# EAGLE design Reg-LT (EAGLE 7.6.0)
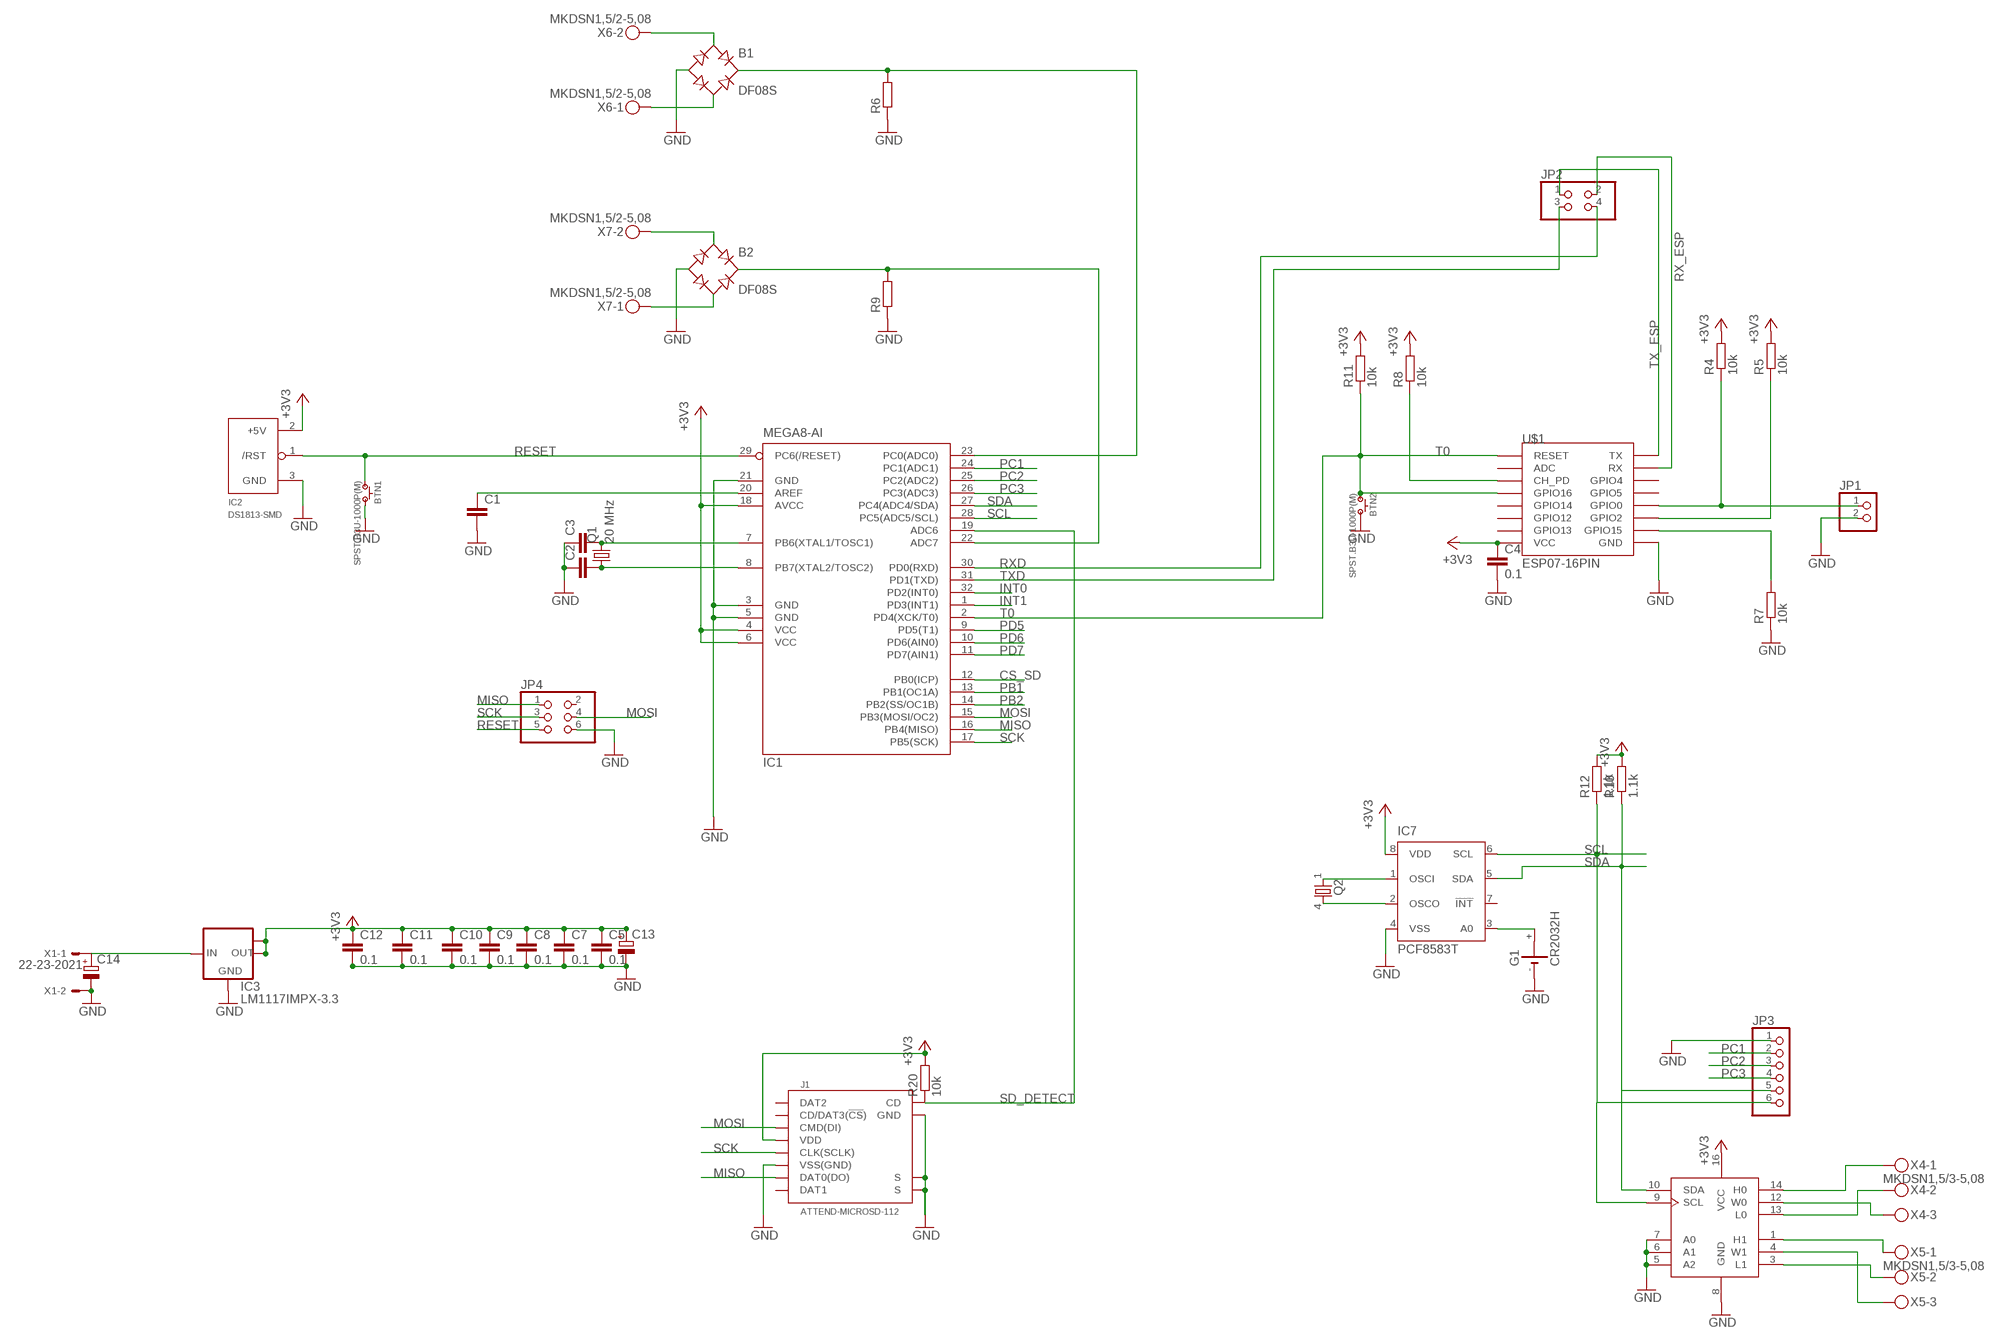
[diagram p0: schematic, sheet 1]

## Parts
B1  DF08S  [DFS]
B2  DF08S  [DFS]
BTN1  SPST.B3U-1000P(M)  [B3U-1000P(M)]
BTN2  SPST.B3U-1000P(M)  [B3U-1000P(M)]
C1  C-EUC0805K  [C0805K]
C2  C-EUC0805  [C0805]
C3  C-EUC0805  [C0805]
C4  0.1  C-EUC0805  [C0805]
C5  0.1  C-EUC0805  [C0805]
C7  0.1  C-EUC0805  [C0805]
C8  0.1  C-EUC0805  [C0805]
C9  0.1  C-EUC0805  [C0805]
C10  0.1  C-EUC0805  [C0805]
C11  0.1  C-EUC0805  [C0805]
C12  0.1  C-EUC0805  [C0805]
C13  CPOL-EU153CLV-0605  [153CLV-0605]
C14  CPOL-EU153CLV-0605  [153CLV-0605]
G1  CR2032H  [CR2032H]
IC1  MEGA8-AI  [TQFP32-08]
IC2  DS1813-SMD  [SOT-23]
IC3  LM1117IMPX-3.3  [SOT223]
IC7  PCF8583T  [SO8-7_5]
J1  ATTEND-MICROSD-112  [ATTEND-112]
JP1  PINHD-1X2  [1X02]
JP2  PINHD-2X2  [2X02]
JP3  PINHD-1X6  [1X06]
JP4  PINHD-2X3  [2X03]
Q1  20 MHz  CRYSTALSM49  [SM49]
Q2  MA306  [MA306]
R4  10k  R-EU_R0805  [R0805]
R5  10k  R-EU_R0805  [R0805]
R6  R-EU_VMTA55  [VMTA55]
R7  10k  R-EU_R0805  [R0805]
R8  10k  R-EU_R0805  [R0805]
R9  R-EU_VMTA55  [VMTA55]
R10  1.1k  R-EU_R0805  [R0805]
R11  10k  R-EU_R0805  [R0805]
R12  1.1k  R-EU_R0805  [R0805]
R20  10k  R-EU_R0805  [R0805]
U$1  ESP07-16PIN  [ESP07-16PIN]
U$5  DS1803ZSO16  [SO16]
X1  22-23-2021  [22-23-2021]
X4  MKDSN1,5/3-5,08  [MKDSN1,5/3-5,08]
X5  MKDSN1,5/3-5,08  [MKDSN1,5/3-5,08]
X6  MKDSN1,5/2-5,08  [MKDSN1,5/2-5,08]
X7  MKDSN1,5/2-5,08  [MKDSN1,5/2-5,08]

## Nets
+3V3: C4.1 C5.1 C7.1 C8.1 C9.1 C10.1 C11.1 C12.1 C13.+ IC1.4(VCC) IC1.6(VCC) IC1.18(AVCC) IC2.2(+5V) IC3.2(OUT) IC3.TAB(OUT1) IC7.8(VDD) J1.VDD R4.2 R5.2 R8.2 R10.2 R11.2 R12.2 R20.2 U$1.VCC U$5.16(VCC)
CS_SD: IC1.12(PB0(ICP))
GND: B1.- B2.- BTN1.2 BTN2.2 C1.2 C2.1 C3.1 C4.2 C5.2 C7.2 C8.2 C9.2 C10.2 C11.2 C12.2 C13.- C14.- G1.- IC1.3(GND) IC1.5(GND) IC1.21(GND) IC2.3(GND) IC3.1(GND) IC7.4(VSS) J1.GND J1.S1(S) J1.S2(S) J1.VSS(VSS(GND)) JP1.2 JP3.1 JP4.6 R6.1 R7.1 R9.1 U$1.GND U$5.5(A2) U$5.6(A1) U$5.7(A0) U$5.8(GND) X1.2
INT0: IC1.32(PD2(INT0))
INT1: IC1.1(PD3(INT1))
MISO: IC1.16(PB4(MISO)) J1.DAT0(DAT0(DO)) JP4.1
MOSI: IC1.15(PB3(MOSI/OC2)) J1.CMD(CMD(DI)) JP4.4
N$1: B2.AC1 X7.2
N$2: C1.1 IC1.20(AREF)
N$3: C3.2 IC1.7(PB6(XTAL1/TOSC1)) Q1.2
N$4: C2.2 IC1.8(PB7(XTAL2/TOSC2)) Q1.1
N$5: B2.AC2 X7.1
N$7: B2.+ IC1.22(ADC7) R9.2
N$8: B1.AC2 X6.1
N$9: JP1.1 R4.1 U$1.GPIO0
N$10: R5.1 U$1.GPIO2
N$11: R7.2 U$1.GPIO15
N$12: R8.1 U$1.CH_PD
N$13: B1.AC1 X6.2
N$15: IC7.1(OSCI) Q2.1
N$16: IC7.2(OSCO) Q2.4
N$18: U$5.13(L0) X4.2
N$23: U$5.12(W0) X4.3
N$24: B1.+ IC1.23(PC0(ADC0)) R6.2
N$25: U$5.14(H0) X4.1
N$26: U$5.1(H1) X5.1
N$27: U$5.3(L1) X5.2
N$28: U$5.4(W1) X5.3
N$33: G1.+ IC7.3(A0)
PB1: IC1.13(PB1(OC1A))
PB2: IC1.14(PB2(SS/OC1B))
PC1: IC1.24(PC1(ADC1)) JP3.2
PC2: IC1.25(PC2(ADC2)) JP3.3
PC3: IC1.26(PC3(ADC3)) JP3.4
PD5: IC1.9(PD5(T1))
PD6: IC1.10(PD6(AIN0))
PD7: IC1.11(PD7(AIN1))
PW: C14.+ IC3.3(IN) X1.1
RESET: BTN1.1 IC1.29(PC6(/RESET)) IC2.1(/RST) JP4.5
RX_ESP: JP2.2 U$1.RX
RXD: IC1.30(PD0(RXD)) JP2.4
SCK: IC1.17(PB5(SCK)) J1.CLK(CLK(SCLK)) JP4.3
SCL: IC1.28(PC5(ADC5/SCL)) IC7.6(SCL) JP3.6 R12.1 U$5.9(SCL)
SD_DETECT: IC1.19(ADC6) J1.CD R20.1
SDA: IC1.27(PC4(ADC4/SDA)) IC7.5(SDA) JP3.5 R10.1 U$5.10(SDA)
T0: BTN2.1 IC1.2(PD4(XCK/T0)) R11.1 U$1.GPIO16 U$1.REST(RESET)
TX_ESP: JP2.1 U$1.TX
TXD: IC1.31(PD1(TXD)) JP2.3
Unconnected: IC7.7(!INT) J1.DAT1 J1.DAT2 J1.DAT3(CD/DAT3(!CS!)) JP4.2 U$1.ADC U$1.GPIO4 U$1.GPIO5 U$1.GPIO12 U$1.GPIO13 U$1.GPIO14

## Library data of the parts
B1 B2 = rectifier:DF*S: Surface Mount Glass Passivated Bridge Rectifiers Source: Source: Comchip Bridge Rectifiers DF005S-G thru DF10S-G.pdf
BTN1 BTN2 = omron:SPST
C1-C5 C7-C12 = rcl:C-EU: CAPACITOR, European symbol
C13 C14 = rcl:CPOL-EU: POLARIZED CAPACITOR, European symbol
G1 = MyLib:CR2032H: LI BATTERY Varta
IC1 = atmel:MEGA8: MICROCONTROLLER 8 Kbytes FLASH, 1 kbytes SRAM, 512 bytes EEPROM, USART, 6-channel 10 bit ADC, 2-channel 8 bit ADC Pin compatible with Atmega48, ATMega88, ATMega168 Source: avr.lbr; MPN: ATMEGA8-16AU; OC_FARNELL: 9171371; OC_NEWARK: 73M8863
IC2 = ds1813_revised:DS1813
IC3 = lm1117:LM1117IMPX-*
IC7 = MyLib:PCF8583: I2C-Bus CLOCK/CALENDAR
J1 = MyLib:ATTEND-MICROSD-112: Attend microSD socket Datasheet: Attend 112 microSD socket <http://www.soselectronic.com/a_info/resource/f/112I-TXAR-R_B_1.pdf>.
JP1 = pinhead:PINHD-1X2: PIN HEADER
JP2 = pinhead:PINHD-2X2: PIN HEADER
JP3 = pinhead:PINHD-1X6: PIN HEADER
JP4 = pinhead:PINHD-2X3: PIN HEADER
Q1 = crystal:CRYSTAL: CRYSTAL; OC_FARNELL: unknown; OC_NEWARK: unknown
Q2 = MyLib:MA306
R4-R12 R20 = rcl:R-EU_: RESISTOR, European symbol
U$1 = esp8266modules:ESP07-16PIN: ESP8266 Wifi module 07 - 16 pins; DIMENSIONS: 22.0 x 16.0 mm; PINS: 16; PITCH: 0.078" / 2 mm
U$5 = MyLib:DS1803Z
X1 = con-molex:22-23-2021: .100" (2.54mm) Center Header - 2 Pin; MF: MOLEX; MPN: 22-23-2021; OC_FARNELL: 1462926; OC_NEWARK: 25C3832
X4 X5 = con-phoenix-508:MKDSN1,5/3-5,08: MKDSN 1,5/ 3-5,08 Printklemme Nennstrom: 13,5 A Nennspannung: 250 V Rastermaß: 5,08 mm Polzahl: 3 Anschlussart: Schraubanschluss Montage: Löten Anschlussrichtung Leiter/Platine: 0 ° Artikelnummer: 1729131 Source: http://eshop.phoenixcontact.com .. 1729131.pdf
X6 X7 = con-phoenix-508:MKDSN1,5/2-5,08: MKDSN 1,5/ 2-5,08 Printklemme Nennstrom: 13,5 A Nennspannung: 250 V Rastermaß: 5,08 mm Polzahl: 2 Anschlussart: Schraubanschluss Montage: Löten Anschlussrichtung Leiter/Platine: 0 ° Artikelnummer: 1729128 Source: http://eshop.phoenixcontact.com .. 1729128.pdf

## Net classes
0 default: clearance 0.205 mm

## Board
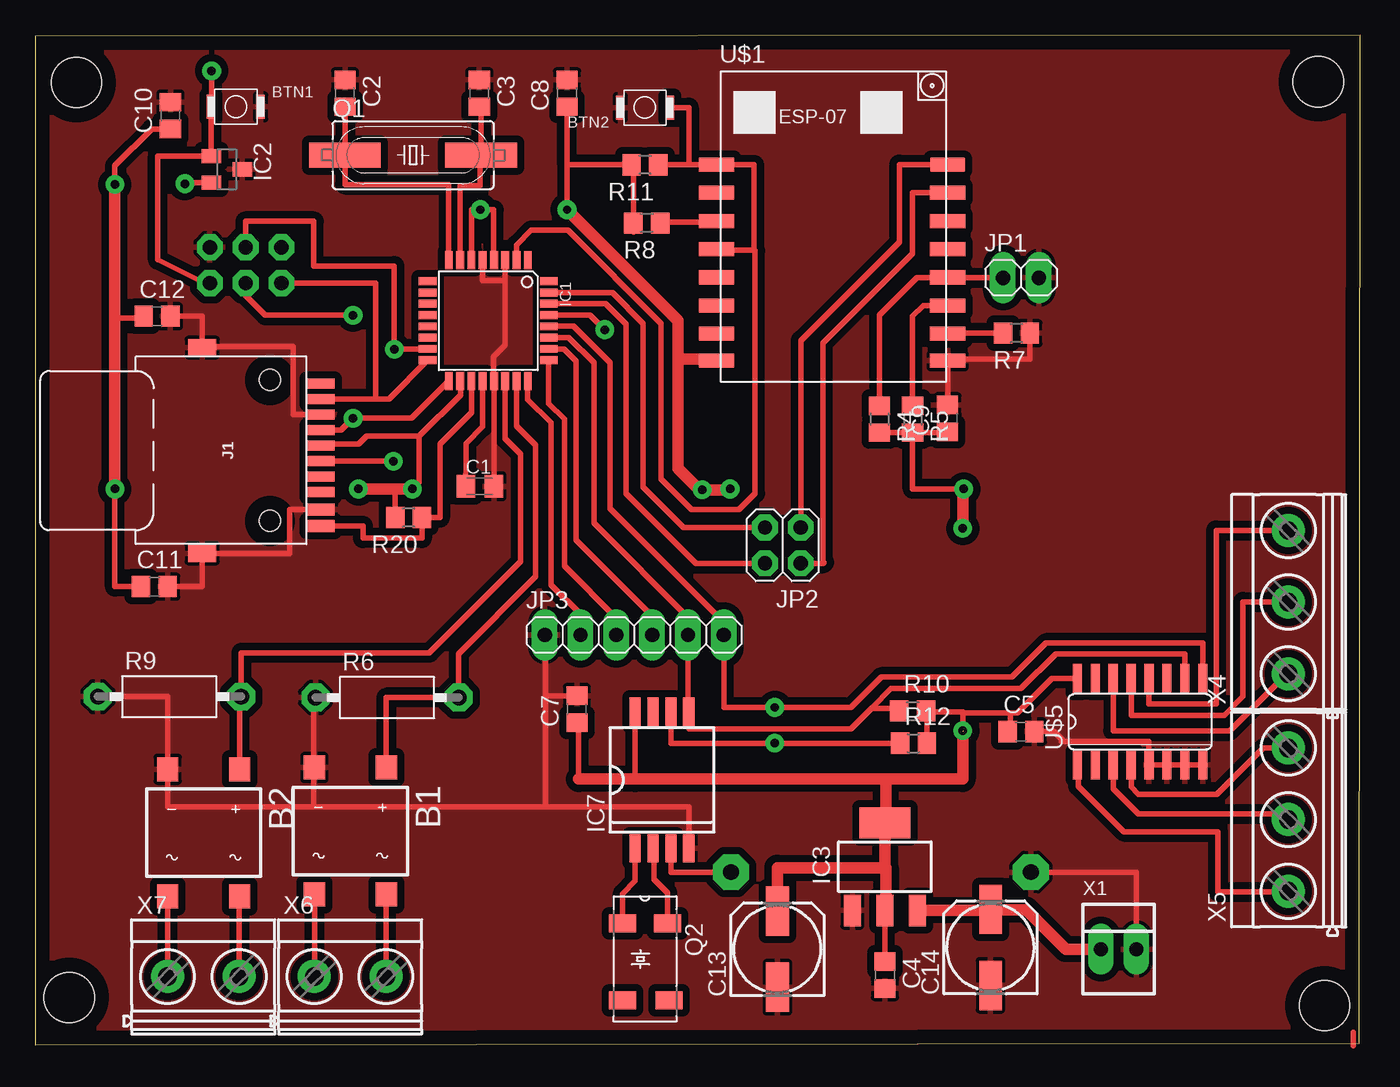
[diagram p1: board, top side]
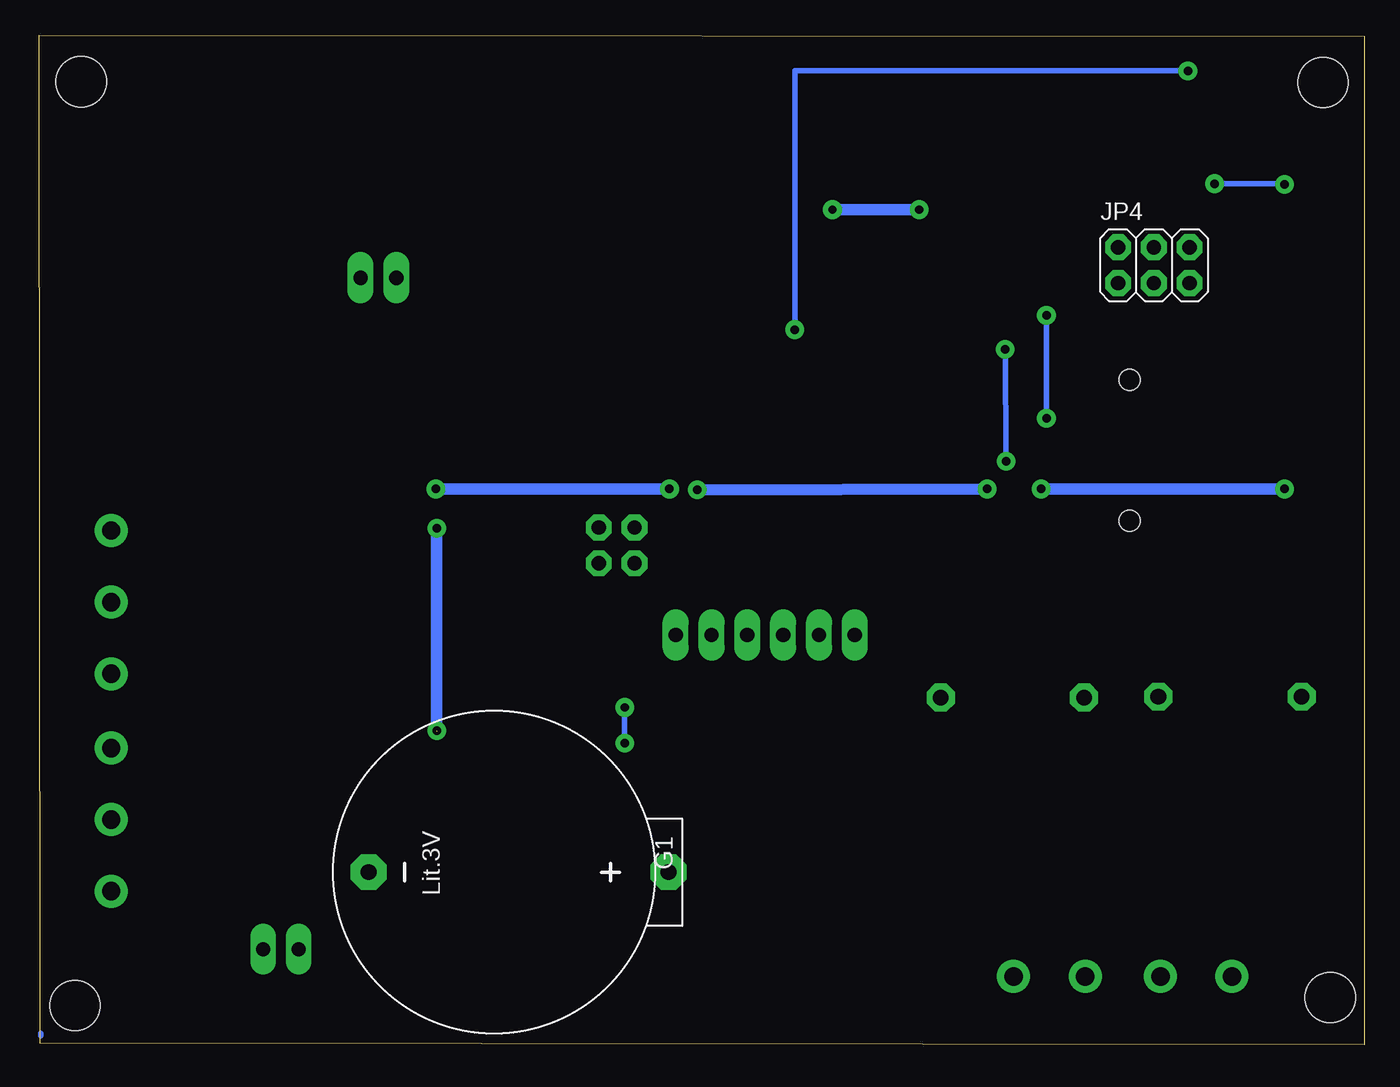
[diagram p2: board, bottom side, seen from below]

Size 93.97 x 71.62 mm. Coordinates in mm from the lower left corner, seen from the top.
Outline: 0,0 93.9,0.13 93.97,71.62 0,71.55 0,0
Copper layers (1*16): Top 0.035mm / dielectric 1.5mm / Bottom 0.035mm
Design rules "default *": minimum track width 10mil, minimum drill 24mil, track to track 20mil, track to pad 20mil, pad to pad 12mil, via to via 12mil, smd to smd 8mil, copper to edge 40mil, drill to drill 40mil, minimum pad ring 10mil, minimum via ring 8mil, stop-mask expansion 4mil, vias tented up to drill 0mil, thermal gap 10mil
Holes 3.56 mm at 2.92,68.26 2.41,3.37 91.44,2.79 91,68.33

### Footprints (pad centres in the part's own frame; a part is rotated, then mirrored left to right if it is on the bottom)
DFS = smd 1.5 x 1.7: + -2.55,-4.5; - 2.55,-4.5; AC1 -2.55,4.5; AC2 2.55,4.5
B3U-1000P(M) = smd 0.6 x 1.7: 1 -1.75,0; 2 1.75,0
C0805K = smd 1.3 x 1.6: 1 -1,0; 2 1,0
C0805 = smd 1.3 x 1.5: 1 -0.95,0; 2 0.95,0
153CLV-0605 = smd 3.5 x 1.6: + 2.7,0; - -2.7,0
CR2032H = drill 1.118 pad 2.54 octagon: + 0,12.383; - 0,-8.89
TQFP32-08 = smd 1.27 x 0.559: 1 -4.293,2.8; 2 -4.293,2; 3 -4.293,1.2; 4 -4.293,0.4; 5 -4.293,-0.4; 6 -4.293,-1.2; 7 -4.293,-2; 8 -4.293,-2.8; 17 4.293,-2.8; 18 4.293,-2; 19 4.293,-1.2; 20 4.293,-0.4; 21 4.293,0.4; 22 4.293,1.2; 23 4.293,2; 24 4.293,2.8 | smd 0.559 x 1.27: 9 -2.8,-4.293; 10 -2,-4.293; 11 -1.2,-4.293; 12 -0.4,-4.293; 13 0.4,-4.293; 14 1.2,-4.293; 15 2,-4.293; 16 2.8,-4.293; 25 2.8,4.293; 26 2,4.293; 27 1.2,4.293; 28 0.4,4.293; 29 -0.4,4.293; 30 -1.2,4.293; 31 -2,4.293; 32 -2.8,4.293
SOT-23 = smd 1 x 1.4: 1 -0.95,-1.1; 2 0.95,-1.1; 3 0,1.1
SOT223 = smd 1.219 x 2.235: 1 -2.311,-3.099; 2 0,-3.099; 3 2.311,-3.099 | smd 3.6 x 2.2: TAB 0,3.099
SO8-7_5 = smd 0.8 x 2: 1 -1.905,-4.845; 2 -0.635,-4.845; 3 0.635,-4.845; 4 1.905,-4.845; 5 1.905,4.845; 6 0.635,4.845; 7 -0.635,4.845; 8 -1.905,4.845
ATTEND-112 = smd 0.85 x 2: CD 5.35,8.62; GND 4.2,8.62 | smd 0.7 x 2: CLK -1.45,8.62; CMD 0.75,8.62; DAT0 -3.65,8.62; DAT1 -4.75,8.62; DAT2 2.95,8.62; DAT3 1.85,8.62; VDD -0.35,8.62; VSS -2.55,8.62 | smd 1.2 x 2: S1 -7.3,0.22; S2 7.3,0.22 | hole 1.5: -5,5.02; 5,5.02
1X02 = drill 1.016 long: 1 -1.27,0; 2 1.27,0
2X02 = drill 1.016 octagon: 1 -1.27,-1.27; 2 -1.27,1.27; 3 1.27,-1.27; 4 1.27,1.27
1X06 = drill 1.016 long: 1 -6.35,0; 2 -3.81,0; 3 -1.27,0; 4 1.27,0; 5 3.81,0; 6 6.35,0
2X03 = drill 1.016 octagon: 1 -2.54,-1.27; 2 -2.54,1.27; 3 0,-1.27; 4 0,1.27; 5 2.54,-1.27; 6 2.54,1.27
SM49 = smd 5.08 x 1.778: 1 -4.826,0; 2 4.826,0
MA306 = smd 1.27 x 1.905: 1 -2.54,-1.27; 2 2.921,-1.27; 3 2.921,2.032; 4 -2.54,1.905
R0805 = smd 1.3 x 1.5: 1 -0.95,0; 2 0.95,0
VMTA55 = drill 1.1 octagon: 1 -5.08,0; 2 5.08,0
ESP07-16PIN = smd 2.5 x 1: ADC -8.2,3.8; CH_PD -8.2,1.8; GND 8.2,-8.105; GPIO0 8.2,-2.2; GPIO2 8.2,-4.2; GPIO4 8.2,1.8; GPIO5 8.2,-0.2; GPIO12 -8.2,-4.2; GPIO13 -8.2,-6.2; GPIO14 -8.2,-2.2; GPIO15 8.2,-6.2; GPIO16 -8.2,-0.2; REST -8.2,5.8; RX 8.2,3.8; TX 8.2,5.8; VCC -8.2,-8.105
SO16 = smd 0.66 x 2.032: 1 -4.445,-3.073; 2 -3.175,-3.073; 3 -1.905,-3.073; 4 -0.635,-3.073; 5 0.635,-3.073; 6 1.905,-3.073; 7 3.175,-3.073; 8 4.445,-3.073; 9 4.445,3.073; 10 3.175,3.073; 11 1.905,3.073; 12 0.635,3.073; 13 -0.635,3.073; 14 -1.905,3.073; 15 -3.175,3.073; 16 -4.445,3.073
22-23-2021 = drill 1 long: 1 -1.27,0; 2 1.27,0
MKDSN1,5/3-5,08 = drill 1.3 pad 2: 1 -7.641,0.025; 2 -2.561,0.025; 3 2.519,0.025
MKDSN1,5/2-5,08 = drill 1.3 pad 2: 1 -2.561,0.025; 2 2.519,0.025

### Placement (x,y rotation side)
B1  22.35,15.18 180 top
B2  11.94,15.05 180 top
BTN1  14.22,66.55 0 top
BTN2  43.24,66.48 180 top
C1  31.53,39.62 0 top
C2  21.97,67.5 270 top
C3  31.5,67.5 270 top
C4  60.26,4.95 270 top
C5  69.91,22.22 0 top
C7  38.42,23.81 90 top
C8  37.72,67.5 90 top
C9  64.71,44.45 90 top
C10  9.59,65.91 90 top
C11  8.45,32.51 0 top
C12  8.64,51.69 0 top
C13  52.64,6.79 90 top
C14  67.75,6.92 90 top
G1  61.72,12.26 270 bottom
IC1  32.13,51.37 270 top
IC2  13.59,62.1 270 top
IC3  60.26,12.64 0 top
IC7  44.45,18.8 0 top
J1  11.62,42.16 270 top
JP1  69.91,54.42 0 top
JP2  53.02,35.43 180 top
JP3  42.48,29.08 0 top
JP4  14.92,55.31 0 bottom
Q1  26.8,63.12 0 top
Q2  42.93,6.1 270 top
R4  59.88,44.39 270 top
R5  62.23,44.39 270 top
R6  24.96,24.64 0 top
R7  69.6,50.48 180 top
R8  43.37,58.29 180 top
R9  9.53,24.7 0 top
R10  62.23,23.69 0 top
R11  43.24,62.42 180 top
R12  62.29,21.4 0 top
R20  26.48,37.4 180 top
U$1  56.52,56.64 0 top
U$5  78.36,22.92 0 top
X1  76.84,6.79 0 top
X4  88.9,33.97 90 top
X5  88.9,18.54 90 top
X6  22.35,4.83 0 top
X7  11.94,4.83 0 top

### Tracks (layer width: path | path; a pad name or v marks a point on that pad's centre or on a via)
+3V3  (via drill 0.6)  (1 unrouted)
  Top 0.406: IC1.4 32.51,55.66 32.51,59.25 v31.56,59.25 30.93,59.25 IC1.6 | 37.72,62.42 v37.72,59.25 | 37.72,62.42 R11.2 42.29,62.23 42.42,62.23 R8.2 42.42,57.66 | 48.32,48.54 U$1.VCC 47.46,48.54 47.31,48.51 | 37.72,62.42 C8.1 | 26.61,39.62 v26.73,39.43 | IC2.2 12.49,60.96 | IC2.2 12.49,61.09 | v10.61,61.09 10.61,61.15 IC2.2 | C10.1 8.26,64.96 5.65,62.36 v5.65,61.02 | IC1.18 30.16,47.05 30.16,46.1 27.24,43.18 | R12.2 63.24,23.69 R10.2 63.18,23.62 65.79,23.62 65.79,23.56 | C4.1 IC3.2 | R20.2 25.53,39.43 25.91,39.43 | C12.1 7.56,51.56 5.65,51.56 | J1.VDD 20.34,42.61 22.92,42.61 23.5,43.18 27.24,43.18 | 26.67,39.5 v26.73,39.43 | 27.24,43.18 27.24,39.94 v26.73,39.43 | R4.2 R5.2 | R5.2 64.64,43.44 C9.1 | 65.79,39.43 62.23,39.43 R5.2 | C7.1 38.54,22.86 38.54,18.86 | C11.1 5.65,32.51 v5.65,39.43 | IC7.8 42.55,18.86 | 65.79,23.56 v65.79,22.29 | C5.1 68.96,22.29 69.15,22.48 69.15,23.56 | U$5.16 72.1,26 69.66,23.56 69.15,23.56 | 69.15,23.56 65.79,23.56
  Top 0.813: v26.73,39.43 25.91,39.43 v22.92,39.43 | v5.65,39.43 5.65,51.56 v5.65,61.02 | C13.+ 52.64,12.57 60.26,12.57 | 60.26,12.57 60.33,12.57 60.33,9.54 IC3.2 | 60.26,12.57 IC3.TAB 60.33,15.74 60.33,18.86 | 45.59,48.64 45.59,40.89 47.12,39.37 v47.31,39.37 49.28,39.37 v49.28,39.43 | 47.31,48.51 47.31,48.64 45.59,48.64 | v65.85,39.43 65.79,39.43 v65.79,36.64 | 45.59,48.64 45.59,51.37 v37.72,59.25 | 65.79,22.22 65.79,18.86 60.33,18.86 | 60.33,18.86 42.55,18.86 38.54,18.86
  Bottom 0.406: v5.65,61.02 5.65,61.09 v10.61,61.09
  Bottom 0.813: v31.56,59.25 v37.72,59.25 | v26.73,39.43 v47.31,39.37 | v65.79,36.64 v65.79,22.29 | v22.92,39.43 v5.65,39.43 | v49.28,39.43 v65.85,39.43
CS_SD
  Top 0.406: IC1.12 27.79,51.82
GND
  Top 0.406: BTN2.2 | 33.33,54.23 IC1.3 | 33.33,54.23 33.33,49.65 32.51,48.83 32.51,47.1 IC1.21 32.53,41.53 C1.2 | IC1.5 31.73,54.23 33.33,54.23 | 64.72,48.52 U$1.GND | JP3.1 36.2,29.08 36.2,24.76 | 36.2,24.76 36.2,16.89 | IC7.4 46.35,16.89 36.2,16.89 | C12.2 11.84,51.69 J1.S1 11.84,49.53 18.29,49.53 18.29,44.71 J1.VSS | U$1.GND 64.72,48.64 70.55,48.64 R7.1 | U$5.8 U$5.7 U$5.6 U$5.5 78.99,21.53 72.96,21.53 | G1.- 78.11,12.26 X1.2 | 64.72,45.4 C9.2 64.72,45.41 U$1.GND | 72.96,21.53 72.77,21.53 | 19.75,16.89 9.39,16.89 B2.- 9.39,24.7 R9.1 | 19.75,16.89 36.2,16.89 | R6.1 19.75,24.64 19.75,19.68 | C7.2 36.2,24.76 | B1.- 19.75,19.68 | 19.75,19.68 19.75,16.89 | C11.2 11.84,32.51 J1.S2 18.03,34.86 18.03,37.96 J1.GND | C5.2 72.26,22.22 72.96,21.53
  Top 0.813: U$1.GND 64.72,48.51
  pour Top: 0,71.75 93.98,71.56 93.98,0.19 0,0.51
MISO
  Top 0.406: IC1.16 25.08,45.81 24.13,45.81 | 24.13,45.81 J1.DAT0 | JP4.1 24.13,54.04 24.13,45.81
MOSI  (via drill 0.6)
  Top 0.406: JP4.4 14.92,58.42 19.75,58.42 19.75,55.25 25.46,55.25 v25.46,49.34 27.84,49.34 IC1.15 | J1.CMD v25.4,41.41 v25.4,41.4
  Bottom 0.406: v25.46,49.34 v25.4,41.4
N$1
  Top 0.406: B2.AC1 14.46,10.55 X7.2
N$2
  Top 0.406: 31.77,47.08 IC1.20 31.73,43.86 30.54,42.67 30.54,41.61 C1.1
N$3
  Top 0.406: C3.2 31.62,66.55 Q1.2 31.56,63.12 31.56,60.96 30.13,60.96 IC1.7
N$4
  Top 0.406: C2.2 Q1.1 21.97,61.02 29.33,61.02 IC1.8
N$5
  Top 0.406: X7.1 9.39,4.85 B2.AC2
N$7
  Top 0.406: B2.+ 14.49,24.7 R9.2 14.61,27.81 27.94,27.81 34.42,34.29 34.42,41.91 33.33,43 IC1.22
N$8
  Top 0.406: X6.1 B1.AC2
N$9
  Top 0.406: JP1.1 64.74,54.42 U$1.GPIO0 64.69,54.42 62.55,54.42 59.88,51.75 R4.1
N$10
  Top 0.406: R5.1 62.23,51.69 62.99,52.45 U$1.GPIO2
N$11
  Top 0.406: 64.72,50.42 U$1.GPIO15 64.72,50.48 R7.2
N$12
  Top 0.406: U$1.CH_PD 48.31,58.36 44.32,58.36 R8.1
N$13
  Top 0.406: X6.2 24.9,4.85 B1.AC1
N$15
  Top 0.406: Q2.1 41.66,10.73 42.55,11.62 IC7.1
N$16
  Top 0.406: Q2.4 44.83,10.79 43.88,11.75 43.88,13.89 IC7.2
N$18
  Top 0.406: 88.85,31.43 X4.2 85.68,31.41 85.66,31.43 85.66,24.7 84.33,23.37 77.72,23.37 U$5.13
N$23
  Top 0.406: 88.85,36.51 X4.3 83.76,36.49 83.76,24.19 78.99,24.19 U$5.12
N$24
  Top 0.406: B1.+ 24.9,24.64 R6.2 30.04,27.75 35.5,33.21 35.5,42.54 34.13,43.91 IC1.23
N$25
  Top 0.406: U$5.14 76.45,22.29 84.71,22.29 88.75,26.33 X4.1
N$26
  Top 0.406: U$5.1 73.98,19.79 73.98,18.35 77.22,15.11 83.88,15.11 83.88,10.86 88.88,10.86 X5.1
N$27
  Top 0.406: U$5.3 76.45,18.16 78.23,16.38 88.47,16.38 X5.2
N$28
  Top 0.406: X5.3 87.1,21.06 83.82,17.78 78.23,17.78 77.72,18.29 U$5.4
N$33
  Top 0.406: G1.+ 45.09,12.26 IC7.3
PC1
  Top 0.406: 38.61,29.15 JP3.2 38.73,29.15 38.73,30.48 36.58,32.64 36.58,44.13 34.93,45.78 IC1.24
PC2
  Top 0.406: IC1.25 36.42,45.49 37.53,44.39 37.53,33.97 41.27,30.23 41.27,29.15 JP3.3 41.08,29.21
PC3
  Top 0.406: IC1.26 37.5,49.37 38.35,48.51 38.35,35.81 43.81,30.35 43.81,29.15 JP3.4
PW
  Top 0.813: IC3.3 67.76,9.54 C14.+ 67.79,9.59 70.3,9.59 73.09,6.79 X1.1
RESET  (via drill 0.6)
  Top 0.406: v12.51,69.09 12.51,66.55 BTN1.1 12.49,66.55 IC2.1 8.7,63.05 8.7,55.69 12,54.04 JP4.5 | IC1.29 39.35,51.77 v40.39,50.74
  Bottom 0.406: v40.39,50.74 40.39,69.09 v12.51,69.09
RX_ESP
  Top 0.406: 64.73,60.45 U$1.RX | 64.66,60.39 U$1.RX | 64.72,60.52 U$1.RX | JP2.2 55.88,34.16 55.94,34.23 55.88,34.23 55.88,49.78 62.23,56.13 62.23,60.44 U$1.RX
RXD
  Top 0.406: IC1.30 40.46,52.57 41.91,51.12 41.91,39.12 46.86,34.16 JP2.4
S$4
  Bottom 0.406: 93.85,0.83 93.85,0.64
S$5
  Top 0.406: 93.47,0.89 93.47,-0.06
SCK  (via drill 0.6)
  Top 0.406: JP4.3 14.92,53.15 16.32,51.75 v22.54,51.75 | J1.CLK 21.71,43.61 v22.54,44.45 26.7,44.45 IC1.17
  Bottom 0.406: v22.54,51.75 v22.54,44.45
SCL  (via drill 0.6)
  Top 0.406: IC1.28 38.18,50.97 40.77,48.39 40.77,38.04 48.83,29.97 JP3.6 48.83,23.94 v52.45,23.94 57.85,23.94 60.01,26.1 69.28,26.1 71.69,28.51 82.8,28.51 U$5.9 | R12.1 v52.45,21.4 45.09,21.4 IC7.6
  Bottom 0.406: v52.45,21.4 v52.45,23.94
SD_DETECT
  Top 0.406: IC1.19 30.93,44.84 28.7,42.61 28.7,37.4 R20.1 27.43,35.94 23.24,35.94 23.24,36.81 J1.CD
SDA
  Top 0.406: R10.1 61.28,23.3 | R10.1 61.34,23.69 | IC1.27 37.84,50.17 39.62,48.39 39.62,37.02 46.42,30.23 46.42,29.21 JP3.5 46.29,23.7 IC7.5 | R10.1 61.09,23.88 59.37,23.88 59.37,23.94 | U$5.10 81.53,27.75 72.39,27.75 69.91,25.27 60.71,25.27 59.37,23.94 | 46.35,23.69 IC7.5 | 46.35,22.48 IC7.5 | 61.21,23.69 R10.1 | 59.37,23.94 57.85,22.42 46.35,22.42 IC7.5
T0
  Top 0.406: U$1.REST 48.31,62.42 | 48.31,62.42 46.35,62.42 | 46.35,62.42 R11.1 | 48.31,62.42 50.99,62.42 50.99,56.39 | 50.99,56.39 48.31,56.39 U$1.GPIO16 | BTN2.1 46.35,66.48 46.35,62.42 | IC1.2 34.13,56.74 35.18,57.79 37.78,57.79 44.39,51.18 44.39,40.13 46.55,37.97 49.91,37.97 51.05,39.12 51.05,56.32 50.99,56.39
TX_ESP
  Top 0.406: JP2.1 54.29,49.97 61.28,56.96 61.28,62.44 U$1.TX
TXD
  Top 0.406: IC1.31 40.93,53.37 43.12,51.18 43.12,39.56 45.97,36.7 JP2.3